# Altium schematic sheet FPGA_Bank_1.SchDoc
size A3
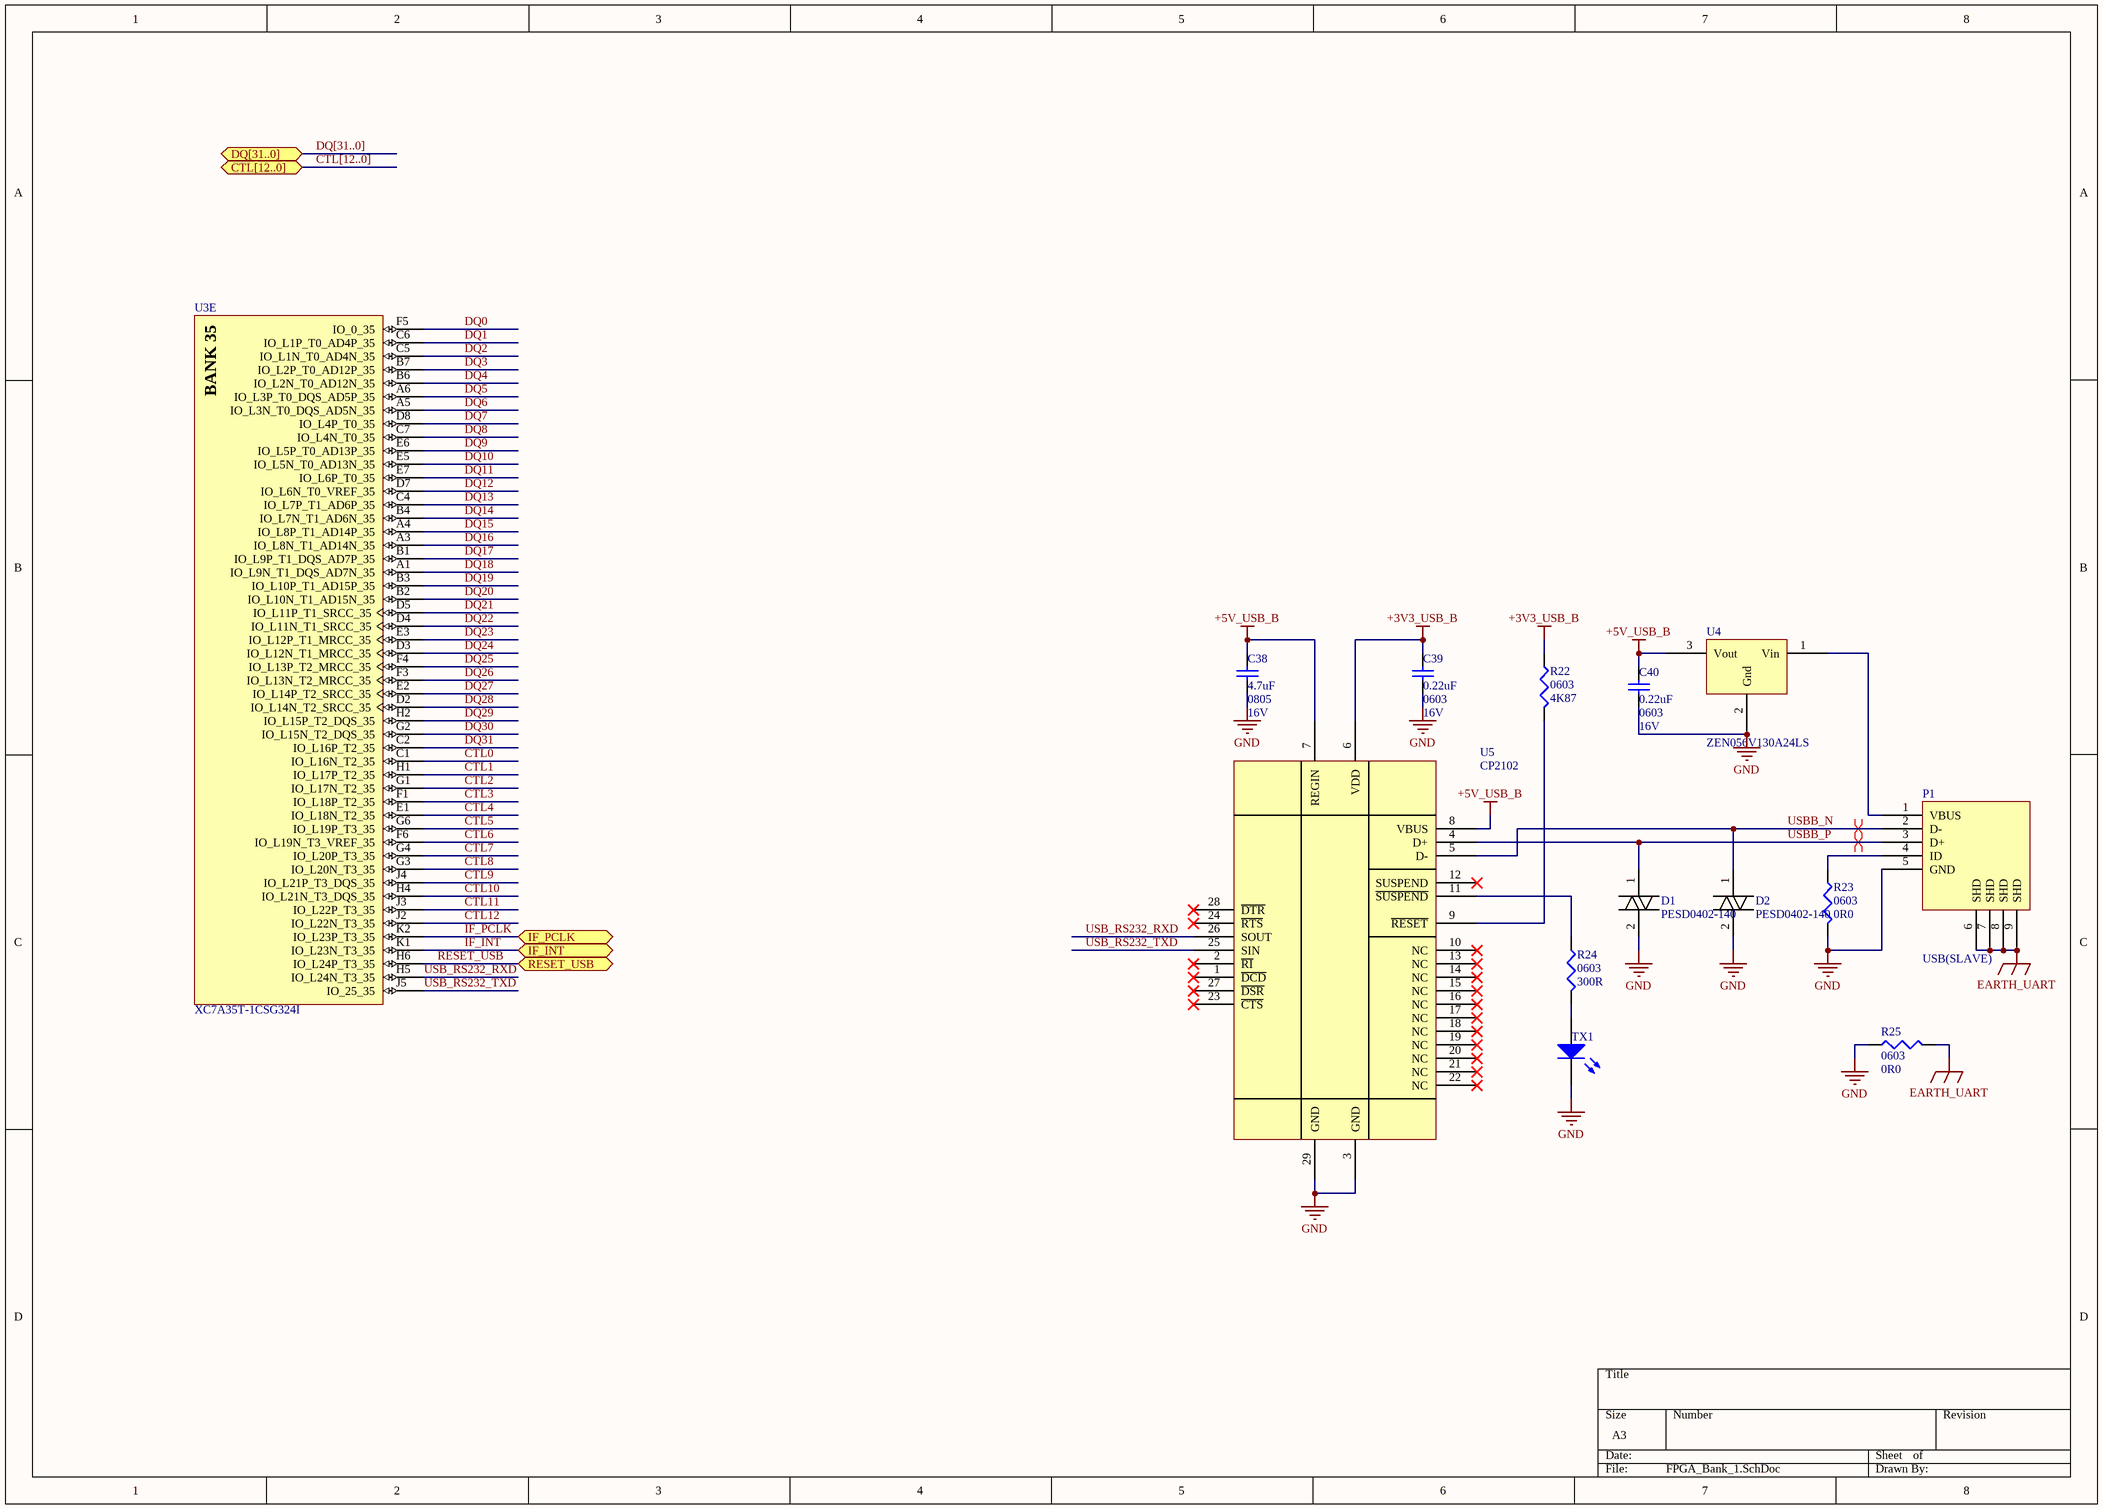
[diagram p0: FPGA_Bank_1.SchDoc]

## Parts
C38  PackageReference: 0805  V: 16V  [2012[0805]]  (hidden comment: 4.7uF)
C39  PackageReference: 0603  V: 16V  [1608[0603]]  (hidden comment: 0.22uF)
C40  PackageReference: 0603  V: 16V  [1608[0603]]  (hidden comment: 0.22uF)
D1  PESD0402-140  [PESD0402-140]
D2  PESD0402-140  [PESD0402-140]
P1  USB(SLAVE)  [USB_MINI_Btype]
R22  value 4K87  PackageReference: 0603  [1608[0603]]  (hidden comment: Res3)
R23  value 0R0  PackageReference: 0603  [1608[0603]]  (hidden comment: Res3)
R24  value 300R  PackageReference: 0603  [1608[0603]]  (hidden comment: Res3)
R25  value 0R0  PackageReference: 0603  [1608[0603]]  (hidden comment: Res3)
TX1  LINK  [0805LED]  (value not drawn)
U3  XC7A35T-1CSG324I  [CSG324]  (part E of 9)
U4  ZEN056V130A24LS  [ZEN056]
U5  CP2102  [CP2102[QFN28]]

## Ports
CTL[12..0], DQ[31..0], IF_INT, IF_PCLK, RESET_USB

## Nets
+3V3_USB_B: C39.1 R22.1 U5.6(VDD)
+5V_USB_B: C38.1 C40.1 U4.3(Vout) U5.7(REGIN) U5.8(VBUS)
EARTH_UART: P1.6(SHD) P1.7(SHD) P1.8(SHD) P1.9(SHD) R25.2
GND: C38.2 C39.2 C40.2 D1.2 D2.2 P1.5(GND) R23.2 R25.1 TX1.2(K) U4.2(Gnd) U5.3(GND) U5.29(GND)
CTL0: U3.C1(IO_L16N_T2_35)
CTL1: U3.H1(IO_L17P_T2_35)
CTL2: U3.G1(IO_L17N_T2_35)
CTL3: U3.F1(IO_L18P_T2_35)
CTL4: U3.E1(IO_L18N_T2_35)
CTL5: U3.G6(IO_L19P_T3_35)
CTL6: U3.F6(IO_L19N_T3_VREF_35)
CTL7: U3.G4(IO_L20P_T3_35)
CTL8: U3.G3(IO_L20N_T3_35)
CTL9: U3.J4(IO_L21P_T3_DQS_35)
CTL10: U3.H4(IO_L21N_T3_DQS_35)
CTL11: U3.J3(IO_L22P_T3_35)
CTL12: U3.J2(IO_L22N_T3_35)
DQ0: U3.F5(IO_0_35)
DQ1: U3.C6(IO_L1P_T0_AD4P_35)
DQ2: U3.C5(IO_L1N_T0_AD4N_35)
DQ3: U3.B7(IO_L2P_T0_AD12P_35)
DQ4: U3.B6(IO_L2N_T0_AD12N_35)
DQ5: U3.A6(IO_L3P_T0_DQS_AD5P_35)
DQ6: U3.A5(IO_L3N_T0_DQS_AD5N_35)
DQ7: U3.D8(IO_L4P_T0_35)
DQ8: U3.C7(IO_L4N_T0_35)
DQ9: U3.E6(IO_L5P_T0_AD13P_35)
DQ10: U3.E5(IO_L5N_T0_AD13N_35)
DQ11: U3.E7(IO_L6P_T0_35)
DQ12: U3.D7(IO_L6N_T0_VREF_35)
DQ13: U3.C4(IO_L7P_T1_AD6P_35)
DQ14: U3.B4(IO_L7N_T1_AD6N_35)
DQ15: U3.A4(IO_L8P_T1_AD14P_35)
DQ16: U3.A3(IO_L8N_T1_AD14N_35)
DQ17: U3.B1(IO_L9P_T1_DQS_AD7P_35)
DQ18: U3.A1(IO_L9N_T1_DQS_AD7N_35)
DQ19: U3.B3(IO_L10P_T1_AD15P_35)
DQ20: U3.B2(IO_L10N_T1_AD15N_35)
DQ21: U3.D5(IO_L11P_T1_SRCC_35)
DQ22: U3.D4(IO_L11N_T1_SRCC_35)
DQ23: U3.E3(IO_L12P_T1_MRCC_35)
DQ24: U3.D3(IO_L12N_T1_MRCC_35)
DQ25: U3.F4(IO_L13P_T2_MRCC_35)
DQ26: U3.F3(IO_L13N_T2_MRCC_35)
DQ27: U3.E2(IO_L14P_T2_SRCC_35)
DQ28: U3.D2(IO_L14N_T2_SRCC_35)
DQ29: U3.H2(IO_L15P_T2_DQS_35)
DQ30: U3.G2(IO_L15N_T2_DQS_35)
DQ31: U3.C2(IO_L16P_T2_35)
IF_INT: U3.K1(IO_L23N_T3_35) ; port IF_INT
IF_PCLK: U3.K2(IO_L23P_T3_35) ; port IF_PCLK
RESET_USB: U3.H6(IO_L24P_T3_35) ; port RESET_USB
USB_RS232_RXD: U3.H5(IO_L24N_T3_35) U5.26(SOUT)
USB_RS232_TXD: U3.J5(IO_25_35) U5.25(SIN)
USBB_N: D2.1 P1.2(D-) U5.5(D-)
USBB_P: D1.1 P1.3(D+) U5.4(D+)
NetP1_1: P1.1(VBUS) U4.1(Vin)
NetP1_4: P1.4(ID) R23.1
NetR22_2: R22.2 U5.9(~{RESET})
NetR24_1: R24.1 U5.11(~{SUSPEND})
NetR24_2: R24.2 TX1.1(A)

Not connected (* = marked no-connect by the designer): U5 1(~{DCD})* 2(~{RI})* 10(NC)* 12(SUSPEND)* 13(NC)* 14(NC)* 15(NC)* 16(NC)* 17(NC)* 18(NC)* 19(NC)* 20(NC)* 21(NC)* 22(NC)* 23(~{CTS})* 24(~{RTS})* 27(~{DSR})* 28(~{DTR})*

## Buses and harness runs
bus CTL[12..0] = port CTL[12..0]
bus DQ[31..0] = port DQ[31..0]

## Layout directives
differential pair: USBB_N, USBB_P

## Notes on the sheet
- (in symbol XC7A35T-1CSG324I, part E) BANK 35

## Library data of the parts
C38-C40 = Cap Semi: Capacitor (Semiconductor SIM Model); LatestRevisionDate: 17-Jul-2002; LatestRevisionNote: Re-released for DXP Platform.; Publisher: Altium Limited
  C38: Value: 4.7uF
  C39 C40: Value: 0.22uF
D1 D2 = PESD0402-140: ESD保护器件
P1 = USB(SLAVE): USB座
R22-R25 = Res3: Resistor; Published: 8-Jun-2000; LatestRevisionDate: 29-May-2009; LatestRevisionNote: IPC-7351 Footprint Added.; Publisher: Altium Limited; PackageDescription: Chip Resistor
TX1 = LED0: Typical INFRARED GaAs LED; Published: 8-Jun-2000; LatestRevisionDate: 08-Jul-2005; LatestRevisionNote: Mech Layer 1 removed.; PackageReference: LED-0; Publisher: Altium Limited
U3 = XC7A35T-1CSG324I: Artix-7 FPGA, 210 User I/Os, 0 GTP, 324-Ball BGA, Speed Grade 1, Industrial Grade, Pb-Free; Manufacturer: Xilinx; Total Block RAM: 1800 Kb; GTP: 0; Clock Mgmt Tiles (CMTs): 5; Logic Cells: 33280; Available User I/O: 210; Speed Grades: 1; DatasheetVersion: v1.15; PackageVersion: Rev. 1.11; PackageReference: CSG-324; PackageDescription: 324-Ball Wire-Bond Chip-Scale BGA, Body 15 x 15 mm, Pitch 0.8 mm; Maximum Distributed RAM: 400 Kb; Operating Temperature Range: Industrial; NexusDeviceID: XC7A35T-1CSG324I; Mounting Technology: Surface Mount; PartNumber: XC7A35T-1CSG324I; ComponentLink1Description: Manufacturer URL; ComponentLink1URL: http://www.xilinx.com/; ComponentLink2Description: Datasheet; ComponentLink2URL: http://www.xilinx.com/support/documentation/data_sheets/ds180_7Series_Overview.pdf; ComponentLink3Description: Package Specification; ComponentLink3URL: http://www.xilinx.com/support/documentation/user_guides/ug475_7Series_Pkg_Pinout.pdf; ComponentLink4Description: DC and Switching Characteristics; ComponentLink4URL: http://www.xilinx.com/support/documentation/data_sheets/ds181_Artix_7_Data_Sheet.pdf; ComponentLink5Description: Package File; ComponentLink5URL: http://www.xilinx.com/support/packagefiles/a7packages/xc7a200tsbg484pkg.txt; ComponentLink6Description: Packaging and Pinout; ComponentLink6URL: http://www.xilinx.com/support/documentation/user_guides/ug475_7Series_Pkg_Pinout.pdf
U4 = ZEN056V130A24LS: 电压瞬态抑制器
U5 = CP2102: Single Chip USB to UART Bridge; MANF: Silicon Labs; FootPrint: CP2102[QFN-28]; Preferred Part Number: CP2102; Value: CP2102